# Altium schematic sheet LED_ROWS.SchDoc: LED Cube 8x8x8 - LED
size A4; Author: Luka Penger; CompanyName: L. Penger; DrawnBy: Luka Penger; Organization: L. Penger; Address1: Luka Penger; Address2: http://lukapenger.eu; Address3: Software & Hardware; Address4: Development; DocumentNumber: 4; Revision: 3.0.0; SheetNumber: 4; SheetTotal: 5; DocumentName: LED ROWS; ProjectName: LED Cube 8x8x8
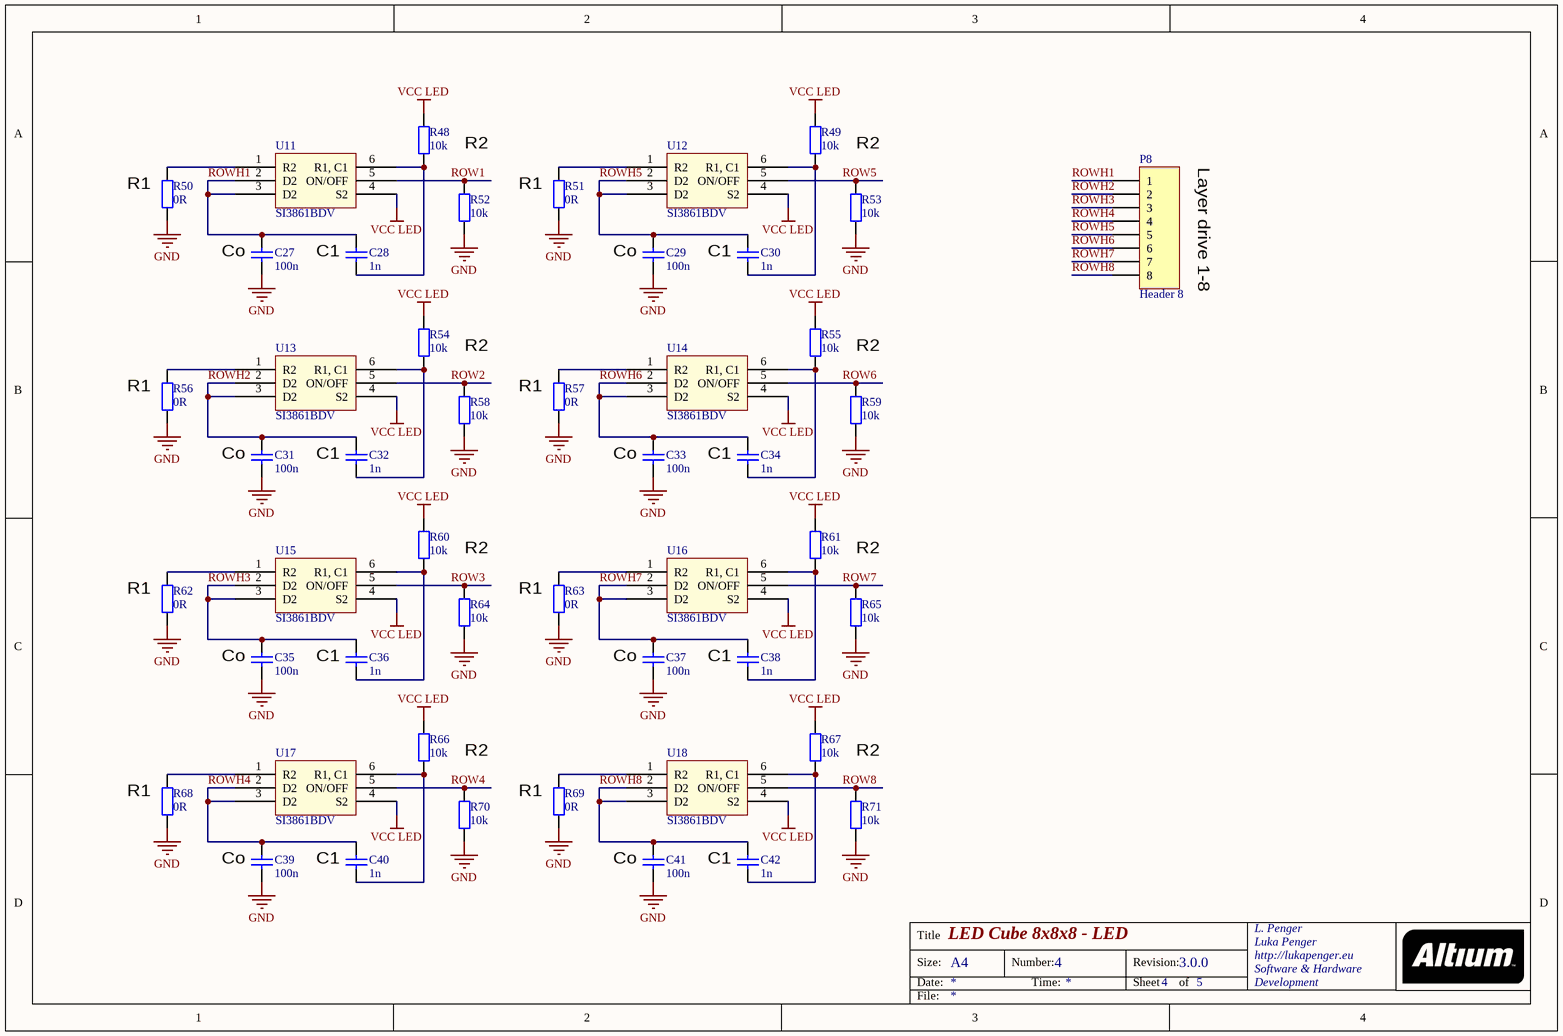
[diagram p0: LED_ROWS.SchDoc]

## Parts
C27  100n  [1608[0603]]
C28  1n  [1608[0603]]
C29  100n  [1608[0603]]
C30  1n  [1608[0603]]
C31  100n  [1608[0603]]
C32  1n  [1608[0603]]
C33  100n  [1608[0603]]
C34  1n  [1608[0603]]
C35  100n  [1608[0603]]
C36  1n  [1608[0603]]
C37  100n  [1608[0603]]
C38  1n  [1608[0603]]
C39  100n  [1608[0603]]
C40  1n  [1608[0603]]
C41  100n  [1608[0603]]
C42  1n  [1608[0603]]
P8  Header 8  [IDC-2x4]
R48  10k  [1608[0603]]
R49  10k  [1608[0603]]
R50  0R  [1608[0603]]
R51  0R  [1608[0603]]
R52  10k  [1608[0603]]
R53  10k  [1608[0603]]
R54  10k  [1608[0603]]
R55  10k  [1608[0603]]
R56  0R  [1608[0603]]
R57  0R  [1608[0603]]
R58  10k  [1608[0603]]
R59  10k  [1608[0603]]
R60  10k  [1608[0603]]
R61  10k  [1608[0603]]
R62  0R  [1608[0603]]
R63  0R  [1608[0603]]
R64  10k  [1608[0603]]
R65  10k  [1608[0603]]
R66  10k  [1608[0603]]
R67  10k  [1608[0603]]
R68  0R  [1608[0603]]
R69  0R  [1608[0603]]
R70  10k  [1608[0603]]
R71  10k  [1608[0603]]
U11  SI3861BDV  [TSOP 6]
U12  SI3861BDV  [TSOP 6]
U13  SI3861BDV  [TSOP 6]
U14  SI3861BDV  [TSOP 6]
U15  SI3861BDV  [TSOP 6]
U16  SI3861BDV  [TSOP 6]
U17  SI3861BDV  [TSOP 6]
U18  SI3861BDV  [TSOP 6]

## Nets
GND: C27.2 C29.2 C31.2 C33.2 C35.2 C37.2 C39.2 C41.2 R50.2 R51.2 R52.1 R53.1 R56.2 R57.2 R58.1 R59.1 R62.2 R63.2 R64.1 R65.1 R68.2 R69.2 R70.1 R71.1
VCC LED: R48.2 R49.2 R54.2 R55.2 R60.2 R61.2 R66.2 R67.2 U11.4(S2) U12.4(S2) U13.4(S2) U14.4(S2) U15.4(S2) U16.4(S2) U17.4(S2) U18.4(S2)
ROW1: R52.2 U11.5(ON/OFF)
ROW2: R58.2 U13.5(ON/OFF)
ROW3: R64.2 U15.5(ON/OFF)
ROW4: R70.2 U17.5(ON/OFF)
ROW5: R53.2 U12.5(ON/OFF)
ROW6: R59.2 U14.5(ON/OFF)
ROW7: R65.2 U16.5(ON/OFF)
ROW8: R71.2 U18.5(ON/OFF)
ROWH1: C27.1 C28.1 P8.1 U11.2(D2) U11.3(D2)
ROWH2: C31.1 C32.1 P8.2 U13.2(D2) U13.3(D2)
ROWH3: C35.1 C36.1 P8.3 U15.2(D2) U15.3(D2)
ROWH4: C39.1 C40.1 P8.4 U17.2(D2) U17.3(D2)
ROWH5: C29.1 C30.1 P8.5 U12.2(D2) U12.3(D2)
ROWH6: C33.1 C34.1 P8.6 U14.2(D2) U14.3(D2)
ROWH7: C37.1 C38.1 P8.7 U16.2(D2) U16.3(D2)
ROWH8: C41.1 C42.1 P8.8 U18.2(D2) U18.3(D2)
NetC28_2: C28.2 R48.1 U11.6(R1,_C1)
NetC30_2: C30.2 R49.1 U12.6(R1,_C1)
NetC32_2: C32.2 R54.1 U13.6(R1,_C1)
NetC34_2: C34.2 R55.1 U14.6(R1,_C1)
NetC36_2: C36.2 R60.1 U15.6(R1,_C1)
NetC38_2: C38.2 R61.1 U16.6(R1,_C1)
NetC40_2: C40.2 R66.1 U17.6(R1,_C1)
NetC42_2: C42.2 R67.1 U18.6(R1,_C1)
NetR50_1: R50.1 U11.1(R2)
NetR51_1: R51.1 U12.1(R2)
NetR56_1: R56.1 U13.1(R2)
NetR57_1: R57.1 U14.1(R2)
NetR62_1: R62.1 U15.1(R2)
NetR63_1: R63.1 U16.1(R2)
NetR68_1: R68.1 U17.1(R2)
NetR69_1: R69.1 U18.1(R2)

## Notes on the sheet
- R2
- Layer drive 1-8
- (near R50) R1
- (near R51) R1
- (near C27) Co
- (near C28) C1
- (near C29) Co
- (near C30) C1
- (near R56) R1
- (near R57) R1
- (near C31) Co
- (near C32) C1
- (near C33) Co
- (near C34) C1
- (near R62) R1
- (near R63) R1
- (near C35) Co
- (near C36) C1
- (near C37) Co
- (near C38) C1
- (near R68) R1
- (near R69) R1
- (near C39) Co
- (near C40) C1
- (near C41) Co
- (near C42) C1
- Title
- Size:
- Date:
- A4
- Number:
- Time:
- Revision:
- Sheet
- of
- File:

## Library data of the parts
C27-C42 = Cap: Capacitor; Value: 100pF; Published: 8-Jun-2000; LatestRevisionDate: 17-Jul-2002; LatestRevisionNote: Re-released for DXP Platform.; PackageReference: RAD-0.3; Publisher: Altium Limited; PackageDescription: Radial Cap, Thru-Hole; 2 Leads; 0.3 in Pin Spacing
P8 = Header 8: Header, 8-Pin; LatestRevisionDate: 17-Jul-2002; LatestRevisionNote: Re-released for DXP Platform.; Publisher: Altium Limited
R48-R71 = Res2: Resistor; Value: 1K; Published: 8-Jun-2000; LatestRevisionDate: 17-Jul-2002; LatestRevisionNote: Re-released for DXP Platform.; PackageReference: AXIAL-0.4; Publisher: Altium Limited; PackageDescription: Axial Device, Thru-Hole; 2 Leads; 0.4 in Pin Spacing
U11-U18 = SI3861BDV: 4.5 - 20V 2.3A Load Switch